# Altium schematic sheet ANALOG_IO.SchDoc
size D; SheetNumber: 7; SheetTotal: 7
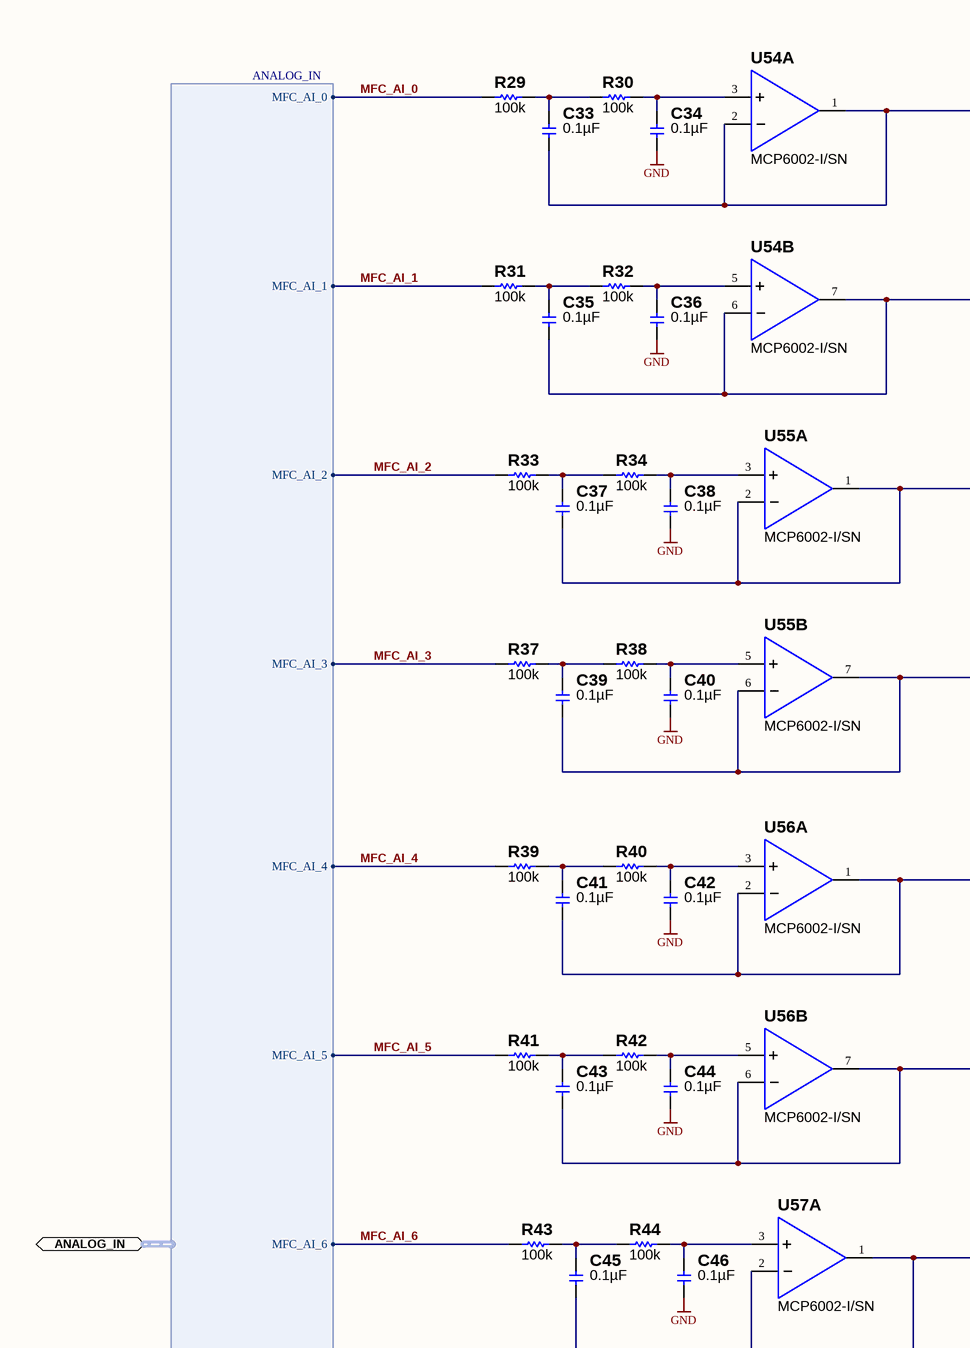
[diagram p0: ANALOG_IO.SchDoc, top left]
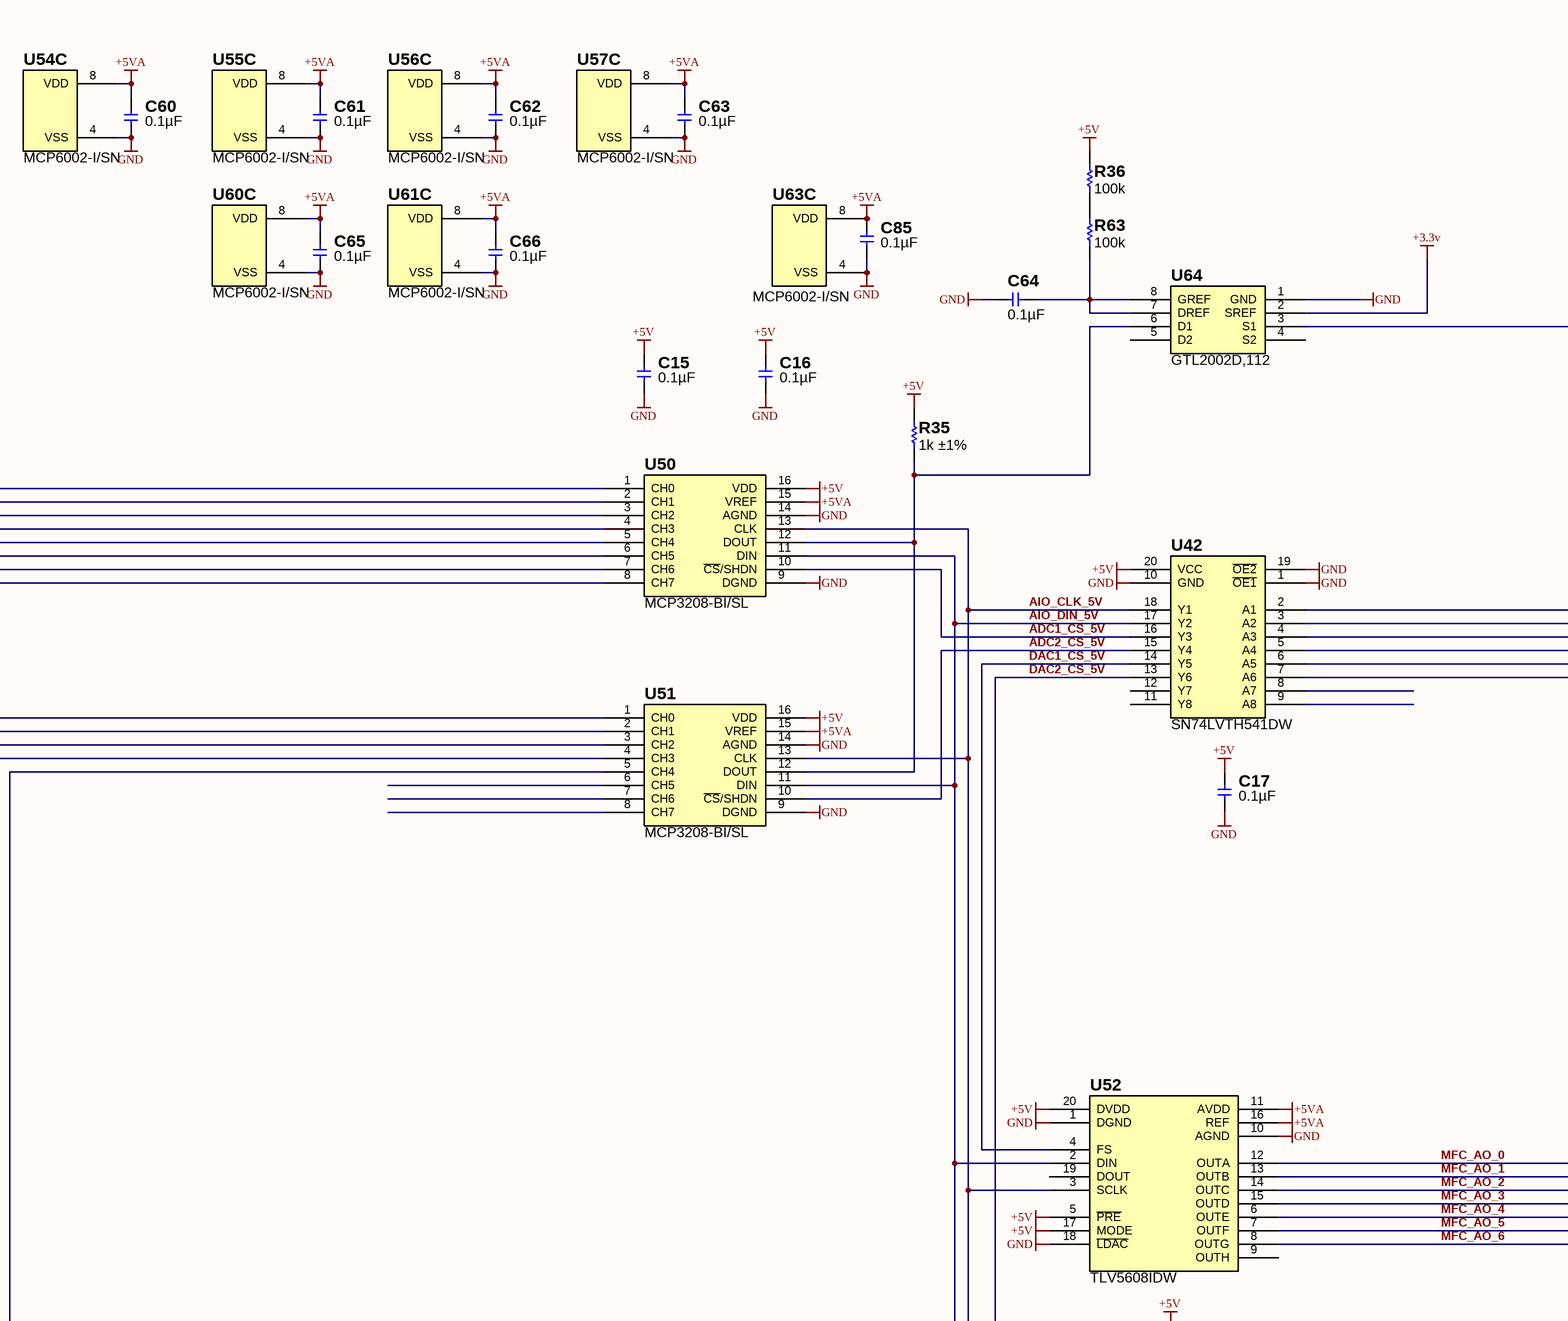
[diagram p1: ANALOG_IO.SchDoc, top middle]
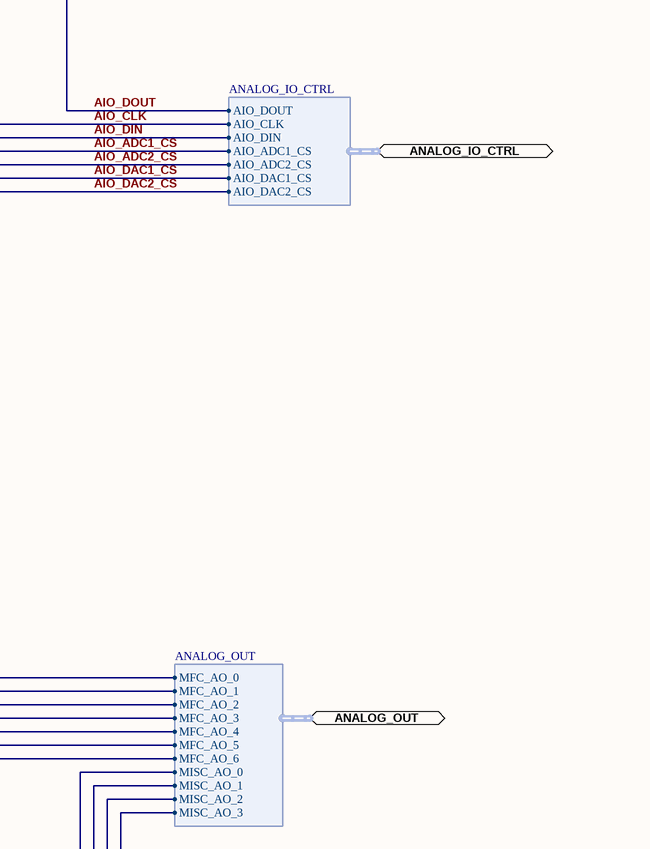
[diagram p2: ANALOG_IO.SchDoc, top right]
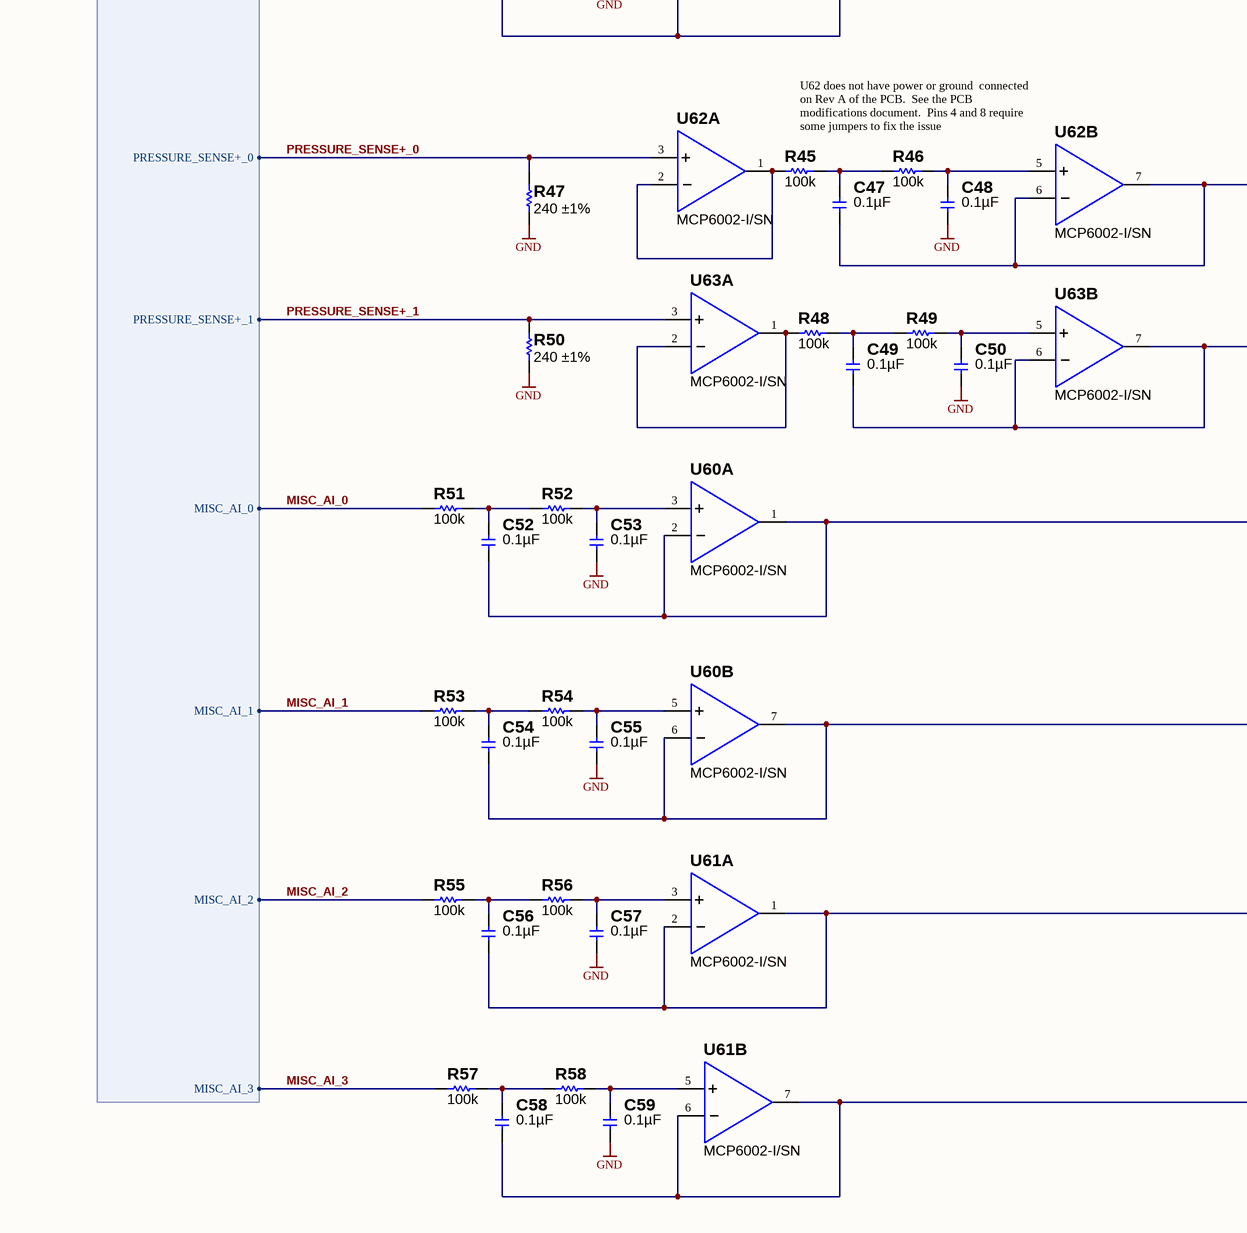
[diagram p3: ANALOG_IO.SchDoc, bottom left]
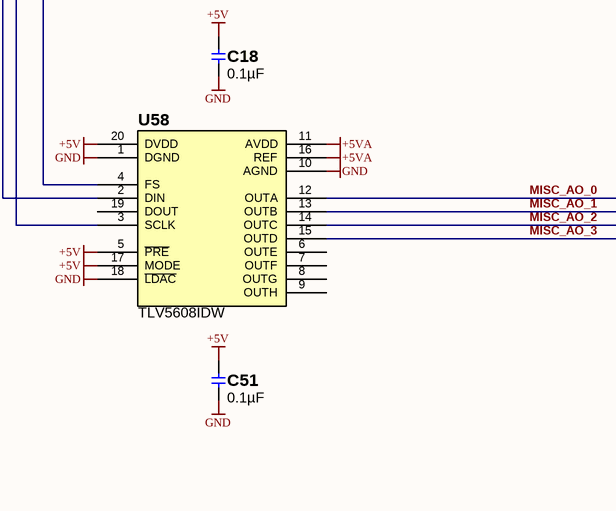
[diagram p4: ANALOG_IO.SchDoc, bottom middle]
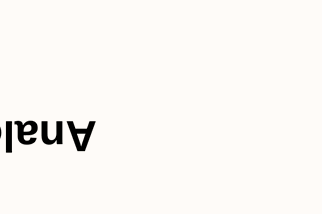
[diagram p5: ANALOG_IO.SchDoc, bottom right]

## Parts
C15  0.1µF  [C0805_LD]
C16  0.1µF  [C0805_LD]
C17  0.1µF  [C0805_LD]
C18  0.1µF  [C0805_LD]
C33  0.1µF  [C0805_LD]
C34  0.1µF  [C0805_LD]
C35  0.1µF  [C0805_LD]
C36  0.1µF  [C0805_LD]
C37  0.1µF  [C0805_LD]
C38  0.1µF  [C0805_LD]
C39  0.1µF  [C0805_LD]
C40  0.1µF  [C0805_LD]
C41  0.1µF  [C0805_LD]
C42  0.1µF  [C0805_LD]
C43  0.1µF  [C0805_LD]
C44  0.1µF  [C0805_LD]
C45  0.1µF  [C0805_LD]
C46  0.1µF  [C0805_LD]
C47  0.1µF  [C0805_LD]
C48  0.1µF  [C0805_LD]
C49  0.1µF  [C0805_LD]
C50  0.1µF  [C0805_LD]
C51  0.1µF  [C0805_LD]
C52  0.1µF  [C0805_LD]
C53  0.1µF  [C0805_LD]
C54  0.1µF  [C0805_LD]
C55  0.1µF  [C0805_LD]
C56  0.1µF  [C0805_LD]
C57  0.1µF  [C0805_LD]
C58  0.1µF  [C0805_LD]
C59  0.1µF  [C0805_LD]
C60  0.1µF  [C0805_LD]
C61  0.1µF  [C0805_LD]
C62  0.1µF  [C0805_LD]
C63  0.1µF  [C0805_LD]
C64  0.1µF  [C0805_LD]
C65  0.1µF  [C0805_LD]
C66  0.1µF  [C0805_LD]
C85  0.1µF  [C0805_LD]
R29  100k  [R0805_LD]
R30  100k  [R0805_LD]
R31  100k  [R0805_LD]
R32  100k  [R0805_LD]
R33  100k  [R0805_LD]
R34  100k  [R0805_LD]
R35  1k ±1%  [R0805_LD]
R36  100k  [R0805_LD]
R37  100k  [R0805_LD]
R38  100k  [R0805_LD]
R39  100k  [R0805_LD]
R40  100k  [R0805_LD]
R41  100k  [R0805_LD]
R42  100k  [R0805_LD]
R43  100k  [R0805_LD]
R44  100k  [R0805_LD]
R45  100k  [R0805_LD]
R46  100k  [R0805_LD]
R47  240 ±1%  [R0805_LD]
R48  100k  [R0805_LD]
R49  100k  [R0805_LD]
R50  240 ±1%  [R0805_LD]
R51  100k  [R0805_LD]
R52  100k  [R0805_LD]
R53  100k  [R0805_LD]
R54  100k  [R0805_LD]
R55  100k  [R0805_LD]
R56  100k  [R0805_LD]
R57  100k  [R0805_LD]
R58  100k  [R0805_LD]
R63  100k  [R0805_LD]
U42  SN74LVTH541DW  [SOIC127P1030X265-20L]
U50  MCP3208-BI/SL  [SOIC127P600X145-16L]
U51  MCP3208-BI/SL  [SOIC127P600X145-16L]
U52  TLV5608IDW  [SOIC127P1030X265-20L]
U54  MCP6002-I/SN  [SOIC 8]  (parts A,B,C of 3)
U55  MCP6002-I/SN  [SOIC 8]  (parts A,B,C of 3)
U56  MCP6002-I/SN  [SOIC 8]  (parts A,B,C of 3)
U57  MCP6002-I/SN  [SOIC 8]  (parts A,C of 3)
U58  TLV5608IDW  [SOIC127P1030X265-20L]
U60  MCP6002-I/SN  [SOIC 8]  (parts A,B,C of 3)
U61  MCP6002-I/SN  [SOIC 8]  (parts A,B,C of 3)
U62  MCP6002-I/SN  [SOIC 8]  (parts A,B of 3)
U63  MCP6002-I/SN  [SOIC 8]  (parts A,B,C of 3)
U64  GTL2002D,112  [SOIC 8]

## Ports
ANALOG_IN (harness ANALOG_IN), ANALOG_IO_CTRL (harness ANALOG_IO_CTRL), ANALOG_OUT (harness ANALOG_OUT)

## Harnesses
ANALOG_IN: MFC_AI_0, MFC_AI_1, MFC_AI_2, MFC_AI_3, MFC_AI_4, MFC_AI_5, MFC_AI_6, PRESSURE_SENSE+_0, PRESSURE_SENSE+_1, MISC_AI_0, MISC_AI_1, MISC_AI_2, MISC_AI_3
ANALOG_OUT: MFC_AO_0, MFC_AO_1, MFC_AO_2, MFC_AO_3, MFC_AO_4, MFC_AO_5, MFC_AO_6, MISC_AO_0, MISC_AO_1, MISC_AO_2, MISC_AO_3
ANALOG_IO_CTRL: AIO_DOUT, AIO_CLK, AIO_DIN, AIO_ADC1_CS, AIO_ADC2_CS, AIO_DAC1_CS, AIO_DAC2_CS

## Nets
+3.3v: U64.2(SREF)
+5V: C15.2 C16.2 C17.2 C18.2 C51.2 R35.2 R36.2 U42.20(VCC) U50.16(VDD) U51.16(VDD) U52.5(~{PRE}) U52.17(MODE) U52.20(DVDD) U58.5(~{PRE}) U58.17(MODE) U58.20(DVDD)
+5VA: C60.2 C61.2 C62.2 C63.2 C65.2 C66.2 C85.2 U50.15(VREF) U51.15(VREF) U52.11(AVDD) U52.16(REF) U54.8(VDD) U55.8(VDD) U56.8(VDD) U57.8(VDD) U58.11(AVDD) U58.16(REF) U60.8(VDD) U61.8(VDD) U63.8(VDD)
GND: C15.1 C16.1 C17.1 C18.1 C34.1 C36.1 C38.1 C40.1 C42.1 C44.1 C46.1 C48.1 C50.1 C51.1 C53.1 C55.1 C57.1 C59.1 C60.1 C61.1 C62.1 C63.1 C64.2 C65.1 C66.1 C85.1 R47.1 R50.1 U42.1(~{OE1}) U42.10(GND) U42.19(~{OE2}) U50.9(DGND) U50.14(AGND) U51.9(DGND) U51.14(AGND) U52.1(DGND) U52.10(AGND) U52.18(~{LDAC}) U54.4(VSS) U55.4(VSS) U56.4(VSS) U57.4(VSS) U58.1(DGND) U58.10(AGND) U58.18(~{LDAC}) U60.4(VSS) U61.4(VSS) U63.4(VSS) U64.1(GND)
ADC1_CS_5V: U42.16(Y3) U50.10(~{CS}/SHDN)
ADC2_CS_5V: U42.15(Y4) U51.10(~{CS}/SHDN)
AIO_ADC1_CS: U42.4(A3) ; port ANALOG_IO_CTRL.AIO_ADC1_CS
AIO_ADC2_CS: U42.5(A4) ; port ANALOG_IO_CTRL.AIO_ADC2_CS
AIO_CLK: U42.2(A1) ; port ANALOG_IO_CTRL.AIO_CLK
AIO_CLK_5V: U42.18(Y1) U50.13(CLK) U51.13(CLK) U52.3(SCLK) U58.3(SCLK)
AIO_DAC1_CS: U42.6(A5) ; port ANALOG_IO_CTRL.AIO_DAC1_CS
AIO_DAC2_CS: U42.7(A6) ; port ANALOG_IO_CTRL.AIO_DAC2_CS
AIO_DIN: U42.3(A2) ; port ANALOG_IO_CTRL.AIO_DIN
AIO_DIN_5V: U42.17(Y2) U50.11(DIN) U51.11(DIN) U52.2(DIN) U58.2(DIN)
AIO_DOUT: U64.3(S1) ; port ANALOG_IO_CTRL.AIO_DOUT
DAC1_CS_5V: U42.14(Y5) U52.4(FS)
DAC2_CS_5V: U42.13(Y6) U58.4(FS)
MFC_AI_0: R29.1 ; port ANALOG_IN.MFC_AI_0
MFC_AI_1: R31.1 ; port ANALOG_IN.MFC_AI_1
MFC_AI_2: R33.1 ; port ANALOG_IN.MFC_AI_2
MFC_AI_3: R37.1 ; port ANALOG_IN.MFC_AI_3
MFC_AI_4: R39.1 ; port ANALOG_IN.MFC_AI_4
MFC_AI_5: R41.1 ; port ANALOG_IN.MFC_AI_5
MFC_AI_6: R43.1 ; port ANALOG_IN.MFC_AI_6
MFC_AO_0: U52.12(OUTA) ; port ANALOG_OUT.MFC_AO_0
MFC_AO_1: U52.13(OUTB) ; port ANALOG_OUT.MFC_AO_1
MFC_AO_2: U52.14(OUTC) ; port ANALOG_OUT.MFC_AO_2
MFC_AO_3: U52.15(OUTD) ; port ANALOG_OUT.MFC_AO_3
MFC_AO_4: U52.6(OUTE) ; port ANALOG_OUT.MFC_AO_4
MFC_AO_5: U52.7(OUTF) ; port ANALOG_OUT.MFC_AO_5
MFC_AO_6: U52.8(OUTG) ; port ANALOG_OUT.MFC_AO_6
MISC_AI_0: R51.1 ; port ANALOG_IN.MISC_AI_0
MISC_AI_1: R53.1 ; port ANALOG_IN.MISC_AI_1
MISC_AI_2: R55.1 ; port ANALOG_IN.MISC_AI_2
MISC_AI_3: R57.1 ; port ANALOG_IN.MISC_AI_3
MISC_AO_0: U58.12(OUTA) ; port ANALOG_OUT.MISC_AO_0
MISC_AO_1: U58.13(OUTB) ; port ANALOG_OUT.MISC_AO_1
MISC_AO_2: U58.14(OUTC) ; port ANALOG_OUT.MISC_AO_2
MISC_AO_3: U58.15(OUTD) ; port ANALOG_OUT.MISC_AO_3
PRESSURE_SENSE+_0: R47.2 U62.3(+) ; port ANALOG_IN.PRESSURE_SENSE+_0
PRESSURE_SENSE+_1: R50.2 U63.3(+) ; port ANALOG_IN.PRESSURE_SENSE+_1
NetC33_1: C33.1 U50.1(CH0) U54.1(OUT) U54.2(-)
NetC33_2: C33.2 R29.2 R30.1
NetC34_2: C34.2 R30.2 U54.3(+)
NetC35_1: C35.1 U50.2(CH1) U54.6(-) U54.7(OUT)
NetC35_2: C35.2 R31.2 R32.1
NetC36_2: C36.2 R32.2 U54.5(+)
NetC37_1: C37.1 U50.3(CH2) U55.1(OUT) U55.2(-)
NetC37_2: C37.2 R33.2 R34.1
NetC38_2: C38.2 R34.2 U55.3(+)
NetC39_1: C39.1 U50.4(CH3) U55.6(-) U55.7(OUT)
NetC39_2: C39.2 R37.2 R38.1
NetC40_2: C40.2 R38.2 U55.5(+)
NetC41_1: C41.1 U50.5(CH4) U56.1(OUT) U56.2(-)
NetC41_2: C41.2 R39.2 R40.1
NetC42_2: C42.2 R40.2 U56.3(+)
NetC43_1: C43.1 U50.6(CH5) U56.6(-) U56.7(OUT)
NetC43_2: C43.2 R41.2 R42.1
NetC44_2: C44.2 R42.2 U56.5(+)
NetC45_1: C45.1 U50.7(CH6) U57.1(OUT) U57.2(-)
NetC45_2: C45.2 R43.2 R44.1
NetC46_2: C46.2 R44.2 U57.3(+)
NetC47_1: C47.1 U50.8(CH7) U62.6(-) U62.7(OUT)
NetC47_2: C47.2 R45.2 R46.1
NetC48_2: C48.2 R46.2 U62.5(+)
NetC49_1: C49.1 U51.1(CH0) U63.6(-) U63.7(OUT)
NetC49_2: C49.2 R48.2 R49.1
NetC50_2: C50.2 R49.2 U63.5(+)
NetC52_1: C52.1 U51.2(CH1) U60.1(OUT) U60.2(-)
NetC52_2: C52.2 R51.2 R52.1
NetC53_2: C53.2 R52.2 U60.3(+)
NetC54_1: C54.1 U51.3(CH2) U60.6(-) U60.7(OUT)
NetC54_2: C54.2 R53.2 R54.1
NetC55_2: C55.2 R54.2 U60.5(+)
NetC56_1: C56.1 U51.4(CH3) U61.1(OUT) U61.2(-)
NetC56_2: C56.2 R55.2 R56.1
NetC57_2: C57.2 R56.2 U61.3(+)
NetC58_1: C58.1 U51.5(CH4) U61.6(-) U61.7(OUT)
NetC58_2: C58.2 R57.2 R58.1
NetC59_2: C59.2 R58.2 U61.5(+)
NetC64_1: C64.1 R63.1 U64.7(DREF) U64.8(GREF)
NetR35_1: R35.1 U50.12(DOUT) U51.12(DOUT) U64.6(D1)
NetR36_1: R36.1 R63.2
NetR45_1: R45.1 U62.1(OUT) U62.2(-)
NetR48_1: R48.1 U63.1(OUT) U63.2(-)

Not connected (* = marked no-connect by the designer): U42 8(A7) 9(A8) 11(Y8) 12(Y7); U51 6(CH5) 7(CH6) 8(CH7); U52 9(OUTH) 19(DOUT); U58 6(OUTE) 7(OUTF) 8(OUTG) 9(OUTH) 19(DOUT); U64 4(S2) 5(D2)

## Notes on the sheet
- U62 does not have power or ground  connected on Rev A of the PCB.  See the PCB modifications document.  Pins 4 and 8 require some jumpers to fix the issue
- Analog Input/Output
- -1
- Wavenumber LLC
- 2pl
- Rev:
- Sheet
- of

## Library data of the parts
C15-C18 C33-C66 C85 = GRM21BR71H104KA01L: CAP CER 0.1UF 50V 10% X7R 0805; Manufacturer: Murata Electronics North America; Value: 0.1µF; Temperature Coefficient: X7R; Manufacturer Part Number: GRM21BR71H104KA01L; ComponentLink1Description: \\altium.sil.arl.psu.edu\Libraries\datasheets\Murata Electronics North America\c02e.pdf; ComponentLink1URL: http://search.murata.co.jp/Ceramy/image/img/A01X/G101/ENG/GRM1555C1HR60WA01-01.pdf; ComponentLink2Description: External Datasheet; ComponentLink2URL: http://www.murata.com/products/catalog/pdf/c02e.pdf; Stocked: 0; Supplier 1: Digi-Key; Supplier Part Number 1: 490-1666-1-ND; Category: Capacitors; Sort Value: 100000; Sort Value Package: 0805_100000; Pricing: 1 = 0.1  ;  10 = 0.046  ;  50 = 0.0248  ;  100 = 0.0209  ;  250 = 0.01712  ;  500 = 0.01464  ;  1000 = 0.0114 (USD); Sales Status: Active; Capacitance: 0.1µF; Voltage - Rated: 50V; Tolerance: ±10%; Mounting Type: Surface Mount- MLCC; Operating Temperature: -55°C ~ 125°C; Applications: General Purpose; Ratings: -; Package / Case: 0805 (2012 Metric); Size / Dimension: 0.079" L x 0.049" W (2.00mm x 1.25mm); Height - Seated (Max): -; Thickness (Max): 0.053" (1.35mm); Lead Spacing: -; Features: -; Packaging: Cut Tape (CT); Lead Style: -; Package: 0805; Thickness: 135
R29-R34 R36-R46 R48 R49 R51-R58 R63 = ERJ-6ENF1003V: RES 100K OHM 1/8W 1% 0805 SMD; Manufacturer: Panasonic Electronic Components; Package Power: 0805  (0.125W); Power (Watts): 0.125W- 1/8W; Temperature Coefficient: ±100ppm/°C; Limiting Element Voltage: 150; Maximum Overload Voltage: 200; Maximum Working Voltage: 111.8V; Value: 100k; Manufacturer Part Number: ERJ-6ENF1003V; ComponentLink1Description: Internal Datasheet; ComponentLink1URL: \\altium.sil.arl.psu.edu\Libraries\datasheets\Panasonic Electronic Components\AOA0000CE2.pdf; ComponentLink2Description: External Datasheet; ComponentLink2URL: http://industrial.panasonic.com/www-data/pdf/AOA0000/AOA0000CE2.pdf; Stocked: 0; Supplier 1: Digi-Key; Supplier Part Number 1: P100KCCT-ND; Category: Resistors; Resistance (Ohms): 100k; Composition: Thick Film; Features: -; Tolerance: ±1%; Package / Case: 0805 (2012 Metric); Footprint: 805; Size / Dimension: 0.079" L x 0.049" W (2.00mm x 1.25mm); Height: 0.028" (0.70mm); Number of Terminations: 2; Packaging: Cut Tape (CT); Sort Value: 100000; Sort Value Package: 805_100000
R35 = ERJ-6ENF1001V: RES 1K OHM 1/8W 1% 0805 SMD; Manufacturer: Panasonic Electronic Components; Package Power: 0805  (0.125W); Power (Watts): 0.125W- 1/8W; Temperature Coefficient: ±100ppm/°C; Limiting Element Voltage: 150; Maximum Overload Voltage: 200; Maximum Working Voltage: 11.2V; Value: 1k ±1%; Manufacturer Part Number: ERJ-6ENF1001V; ComponentLink1Description: Internal Datasheet; ComponentLink1URL: \\altium.sil.arl.psu.edu\Libraries\datasheets\Panasonic Electronic Components\AOA0000CE2.pdf; ComponentLink2Description: External Datasheet; ComponentLink2URL: http://industrial.panasonic.com/www-data/pdf/AOA0000/AOA0000CE2.pdf; Stocked: 0; Supplier 1: Digi-Key; Supplier Part Number 1: P1.00KCCT-ND; Category: Resistors; Resistance (Ohms): 1k; Composition: Thick Film; Features: -; Tolerance: ±1%; Package / Case: 0805 (2012 Metric); Footprint: 805; Size / Dimension: 0.079" L x 0.049" W (2.00mm x 1.25mm); Height: 0.028" (0.70mm); Number of Terminations: 2; Packaging: Cut Tape (CT); Sort Value: 1000; Sort Value Package: 805_1000
R47 R50 = ERJ-6ENF2400V: RES 240 OHM 1/8W 1% 0805 SMD; Manufacturer: Panasonic Electronic Components; Package Power: 0805  (0.125W); Resistance (Ohms): 240; Power (Watts): 0.125W- 1/8W; Temperature Coefficient: ±100ppm/°C; Limiting Element Voltage: 150; Maximum Overload Voltage: 200; Maximum Working Voltage: 5.5V; Value: 240 ±1%; Manufacturer Part Number: ERJ-6ENF2400V; ComponentLink1Description: Internal Datasheet; ComponentLink1URL: \\altium.sil.arl.psu.edu\Libraries\datasheets\Panasonic Electronic Components\AOA0000CE2.pdf; ComponentLink2Description: External Datasheet; ComponentLink2URL: http://industrial.panasonic.com/www-data/pdf/AOA0000/AOA0000CE2.pdf; Stocked: 0; Supplier 1: Digi-Key; Supplier Part Number 1: P240CCT-ND; Category: Resistors; Composition: Thick Film; Features: -; Tolerance: ±1%; Package / Case: 0805 (2012 Metric); Footprint: 805; Size / Dimension: 0.079" L x 0.049" W (2.00mm x 1.25mm); Height: 0.028" (0.70mm); Number of Terminations: 2; Packaging: Cut Tape (CT); Sort Value: 240; Sort Value Package: 805_240
U42 = SN74LVTH541DW: IC BUFF/DVR TRI-ST 8BIT 20SOIC; Manufacturer: Texas Instruments; Logic Type: Buffer/Line Driver, Non-Inverting; Number of Elements: 1; Number of Bits per Element: 8; Current - Output High, Low: 32mA, 64mA; Voltage - Supply: 2.7 V ~ 3.6 V; Value: SN74LVTH541DW; Supplier 1: Digi-Key; Supplier Part Number 1: 296-8728-5-ND; Manufacturer Part Number: SN74LVTH541DW; RoHS: RoHS Compliant; Category: Integrated Circuits (ICs); Stock 1: 8053; Pricing 1: 1=2.02, 25=1.6252, 100=1.4625, 250=1.3, 500=1.1375, 1000=0.9425, 2500=0.8775, 5000=0.845, 10000=0.8125 (USD); Packaging: Tube; Operating Temperature: -40°C ~ 85°C; Mounting Type: Surface Mount; Package / Case: 20-SOIC (0.295", 7.50mm Width); Supplier Device Package: 20-SOIC; ComponentLink1URL: http://www.ti.com/lit/ds/symlink/sn74lvth541.pdf; ComponentLink1Description: http://www.ti.com/lit/ds/symlink/sn74lvth541.pdf
U50 U51 = MCP3208-BI/SL: IC ADC 12BIT 2.7V 8CH SPI 16SOIC; Manufacturer: Microchip Technology; Number of Bits: 12; Sampling Rate (Per Second): 100k; Data Interface: Serial, SPI™; Number of Converters: 1; Voltage Supply Source: Single Supply; Number of Inputs and Type: 8 Single-Ended, Unipolar; 4 Pseudo-Differential, Unipolar; Value: MCP3208-BI/SL; Supplier 1: Digi-Key; Supplier Part Number 1: MCP3208-BI/SL-ND; Manufacturer Part Number: MCP3208-BI/SL; RoHS: RoHS Compliant; Category: Integrated Circuits (ICs); Stock 1: 1152; Pricing 1: 1=5.22, 10=4.35, 25=3.62, 100=3.29 (USD); Packaging: Tube; Power Dissipation (Max): -; Operating Temperature: -40°C ~ 85°C; Mounting Type: Surface Mount; Package / Case: 16-SOIC (0.154", 3.90mm Width); Supplier Device Package: 16-SOIC; ComponentLink1URL: http://ww1.microchip.com/downloads/en/DeviceDoc/21298E.pdf; ComponentLink1Description: http://ww1.microchip.com/downloads/en/DeviceDoc/21298E.pdf
U52 U58 = TLV5608IDW: IC 8 CHANNEL DAC S/O 20-SOIC; Manufacturer: Texas Instruments; Settling Time: 3µs; Number of Bits: 10; Data Interface: Serial; Number of Converters: 8; Voltage Supply Source: Analog and Digital; Power Dissipation (Max): 18mW; Number of Outputs and Type: 8 Voltage, Unipolar; Sampling Rate (Per Second): 283k; Value: TLV5608IDW; Supplier 1: Digi-Key; Supplier Part Number 1: 296-3036-5-ND; Manufacturer Part Number: TLV5608IDW; RoHS: RoHS Compliant; Category: Integrated Circuits (ICs); Stock 1: 372; Pricing 1: 1=12.34, 25=10.3784, 100=7.5735, 250=7.43324, 500=7.293, 750=7.15275, 1000=7.0125 (USD); Packaging: Tube; Operating Temperature: -40°C ~ 85°C; Mounting Type: Surface Mount; Package / Case: 20-SOIC (0.295", 7.50mm Width); Supplier Device Package: 20-SOIC; ComponentLink1URL: http://www.ti.com/lit/ds/symlink/tlv5608.pdf; ComponentLink1Description: http://www.ti.com/lit/ds/symlink/tlv5608.pdf
U54-U57 U60-U63 = MCP6002-I/SN: IC OPAMP 1.8V 1MHZ DUAL 8-SOIC; Manufacturer: Microchip Technology; Amplifier Type: General Purpose; Number of Circuits: 2; Output Type: Rail-to-Rail; Slew Rate: 0.6 V/µs; Current - Input Bias: 1pA; Voltage - Input Offset: 4.5mV; Current - Supply: 100µA; Current - Output / Channel: 23mA; Voltage - Supply, Single/Dual (±): 1.8 V ~ 6 V; Value: MCP6002-I/SN; Supplier 1: Digi-Key; Supplier Part Number 1: MCP6002-I/SN-ND; Manufacturer Part Number: MCP6002-I/SN; RoHS: RoHS Compliant; Category: Integrated Circuits (ICs); Stock 1: 45024; Pricing 1: 1=0.4, 10=0.33, 25=0.28, 100=0.25 (USD); Packaging: Tube; Gain Bandwidth Product: 1MHz; -3db Bandwidth: -; Operating Temperature: -40°C ~ 85°C; Mounting Type: Surface Mount; Package / Case: 8-SOIC (0.154", 3.90mm Width); Supplier Device Package: 8-SOIC N; ComponentLink1URL: http://ww1.microchip.com/downloads/en/DeviceDoc/21733j.pdf; ComponentLink1Description: http://ww1.microchip.com/downloads/en/DeviceDoc/21733j.pdf
U64 = GTL2002D,112: IC XLATR 2BIT BI-DIREC 8SOIC; Manufacturer: NXP Semiconductors; Logic Function: Translator, Bidirectional; Number of Bits: 2; Input Type: Voltage; Number of Outputs/Channel: 1; Differential - Input:Output: No/No; Propagation Delay (Max): 1.5ns; Voltage - Supply: 3 V ~ 3.6 V; Value: GTL2002D,112; Supplier 1: Digi-Key; Supplier Part Number 1: 568-4224-5-ND; Manufacturer Part Number: GTL2002D,112; RoHS: RoHS Compliant; Category: Integrated Circuits (ICs); Stock 1: 2000; Pricing 1: 1=0.84, 10=0.735, 25=0.6512, 100=0.567, 250=0.49352, 500=0.42, 1000=0.336, 2500=0.3045, 5000=0.2835 (USD); Packaging: Tube; Output Type: Voltage; Data Rate: -; Number of Channels: 2; Operating Temperature: -40°C ~ 85°C; Package / Case: 8-SOIC (0.154", 3.90mm Width); Supplier Device Package: 8-SO; ComponentLink1URL: http://www.nxp.com/documents/data_sheet/GTL2002.pdf; ComponentLink1Description: http://www.nxp.com/documents/data_sheet/GTL2002.pdf